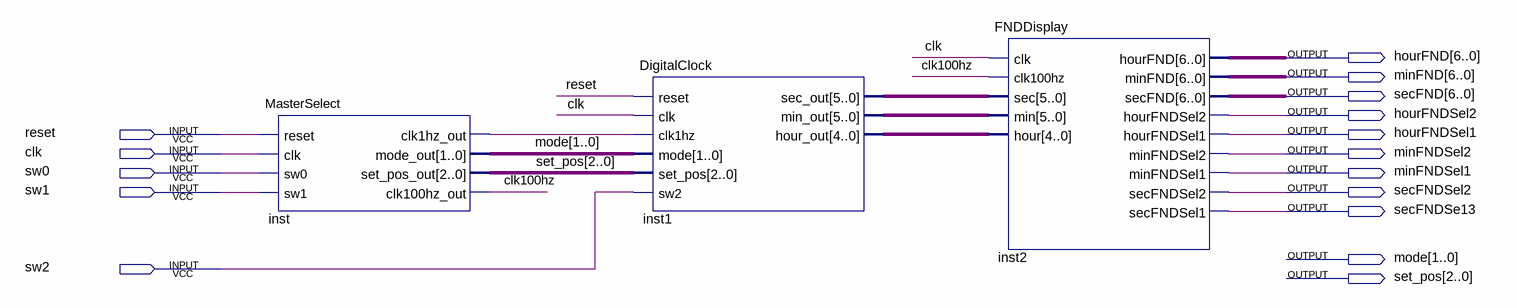
[diagram p0: schematic sheet]
// Quartus schematic DigitalWatch.bdf as structural Verilog: 3 symbols, 16 pins
module DigitalWatch (
  input  reset,
  input  clk,
  input  sw0,
  input  sw1,
  input  sw2,
  output [6:0] hourFND,
  output [6:0] minFND,
  output [6:0] secFND,
  output hourFNDSel2,
  output hourFNDSel1,
  output minFNDSel2,
  output minFNDSel1,
  output secFNDSel2,
  output secFNDSe13,
  output [1:0] mode,
  output [2:0] set_pos
);

  wire clk100hz, inst_clk1hz_out;
  wire [4:0] inst1_hour_out;
  wire [5:0] inst1_min_out, inst1_sec_out;

  MasterSelect inst (
    .reset(reset), .clk(clk), .sw0(sw0), .sw1(sw1), .clk1hz_out(inst_clk1hz_out), .mode_out(mode),
    .set_pos_out(set_pos), .clk100hz_out(clk100hz));
  DigitalClock inst1 (
    .reset(reset), .clk(clk), .clk1hz(inst_clk1hz_out), .mode(mode), .set_pos(set_pos), .sw2(sw2),
    .sec_out(inst1_sec_out), .min_out(inst1_min_out), .hour_out(inst1_hour_out));
  FNDDisplay inst2 (
    .clk(clk), .clk100hz(clk100hz), .sec(inst1_sec_out), .min(inst1_min_out), .hour(inst1_hour_out),
    .hourFND(hourFND), .minFND(minFND), .secFND(secFND), .hourFNDSel2(hourFNDSel2),
    .hourFNDSel1(hourFNDSel1), .minFNDSel2(minFNDSel2), .minFNDSel1(minFNDSel1), .secFNDSel2(secFNDSel2),
    .secFNDSel1(secFNDSe13));
endmodule
